# EAGLE design MPHS-RFM69C (EAGLE 7.4.0)
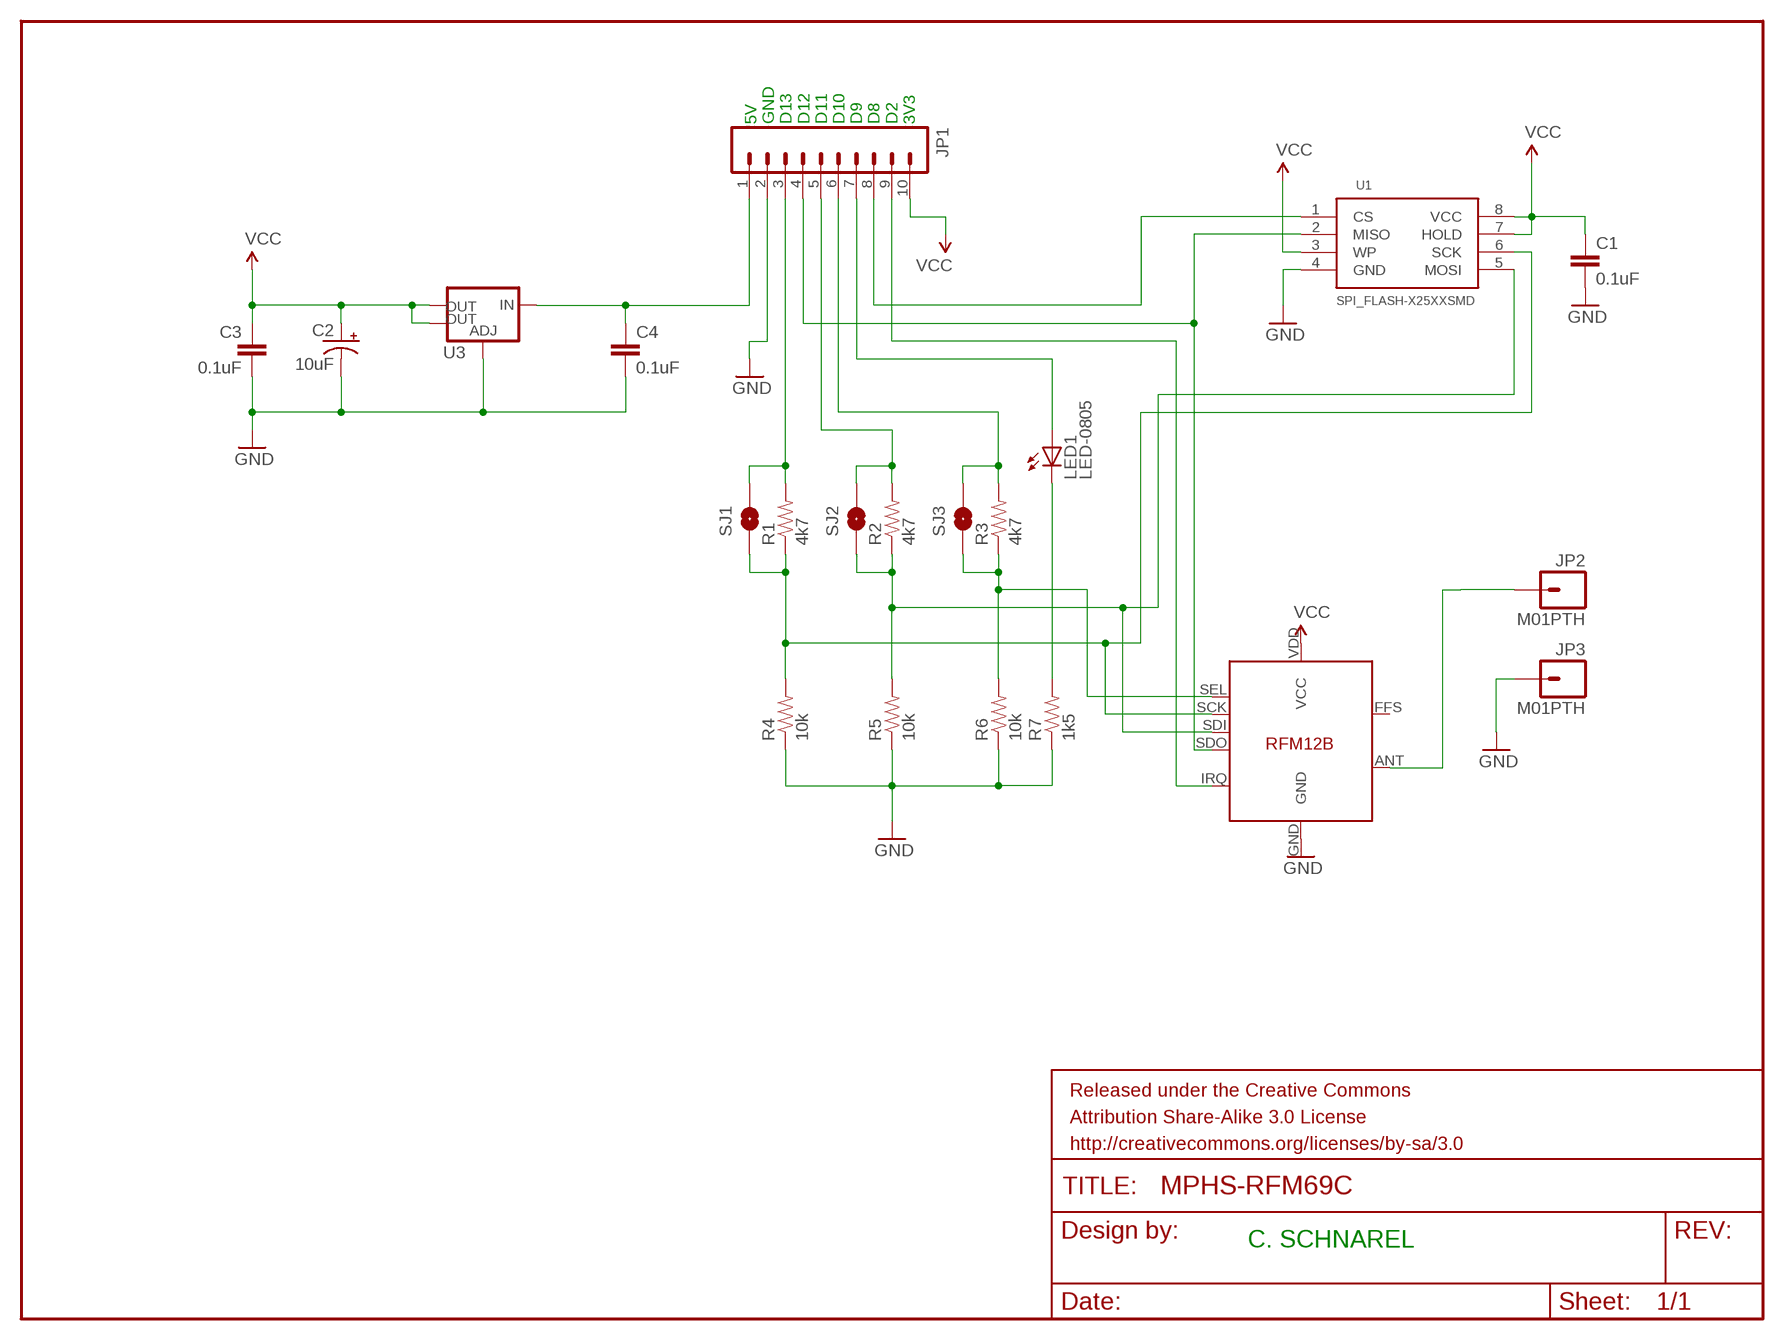
[diagram p0: schematic, sheet 1]

## Parts
C1  0.1uF  CAP0805  [0805]
C2  10uF  CAP_POL0805  [0805-POL]
C3  0.1uF  CAP0805  [0805]
C4  0.1uF  CAP0805  [0805]
FRAME1  FRAME-LETTER  [CREATIVE_COMMONS]
JP1  M10"  [1X10]
JP2  M01PTH  [1X01]
JP3  M01PTH  [1X01]
LED1  LED-0805  [0805-LED]
R1  4k7  RESISTOR0805-RES  [0805]
R2  4k7  RESISTOR0805-RES  [0805]
R3  4k7  RESISTOR0805-RES  [0805]
R4  10k  RESISTOR0805-RES  [0805]
R5  10k  RESISTOR0805-RES  [0805]
R6  10k  RESISTOR0805-RES  [0805]
R7  1k5  RESISTOR0805-RES  [0805]
SJ1  SOLDERJUMPERNO  [SJ_2S-NO]
SJ2  SOLDERJUMPERNO  [SJ_2S-NO]
SJ3  SOLDERJUMPERNO  [SJ_2S-NO]
U1  SPI_FLASH-X25XXSMD  [SO08]
U3  V_REG_LM1117SOT223  [SOT223]
U$1  RFM12B  [RFM12B]

## Nets
GND: C1.2 C2.2(-) C3.2 C4.2 JP1.2 JP3.1 R4.1 R5.1 R6.1 R7.1 U1.4(GND) U3.1(ADJ) U$1.GND
N$1: R3.1 R6.2 SJ3.1 U$1.SEL
N$2: C4.1 JP1.1 U3.3(IN)
N$3: JP1.4 U1.2(MISO) U$1.SDO
N$4: JP1.9 U$1.IRQ
N$5: R2.1 R5.2 SJ2.1 U1.5(MOSI) U$1.SDI
N$6: JP1.3 R1.2 SJ1.2
N$7: JP1.5 R2.2 SJ2.2
N$9: JP1.6 R3.2 SJ3.2
N$10: R1.1 R4.2 SJ1.1 U1.6(SCK) U$1.SCK
N$11: JP2.1 U$1.ANT
N$13: JP1.7 LED1.A
N$14: JP1.8 U1.1(CS)
N$15: LED1.C R7.2
VCC: C1.1 C2.1(+) C3.1 JP1.10 U1.3(WP) U1.7(HOLD) U1.8(VCC) U3.2(OUT) U3.4(OUT) U$1.VDD(VCC)
Unconnected: U$1.FFS

## Notes on the sheet
- 5V
  GND
  D13
  D12
  D11
  D10
  D9
  D8
  D2
  3V3
- C. SCHNAREL

## Library data of the parts
C1 C3 C4 = SparkFun-Capacitors:CAP: Capacitor Standard 0603 ceramic capacitor, and 0.1" leaded capacitor.
C2 = ChipsParts:CAP_POL
FRAME1 = SparkFun-Aesthetics:FRAME-LETTER: Schematic Frame Standard 8.5x11 US Letter frame
JP1 = SparkFun-Connectors:M10: Header 10 Standard 10-pin 0.1" header. Use with straight break away headers (SKU : PRT-00116), right angle break away headers (PRT-00553), swiss pins (PRT-00743), machine pins (PRT-00117), and female headers (PRT-00115).
JP2 JP3 = SparkFun-Connectors:M01: Header 1 Standard 1-pin 0.1" header. Use with straight break away headers (SKU : PRT-00116), right angle break away headers (PRT-00553), swiss pins (PRT-00743), machine pins (PRT-00117), and female headers (PRT-00115).
LED1 = ChipsParts:LED: Generic LED in 0805 package. Both package and symbol copied from SparkFun libraries but they don't have a component LED in 0805.
R1-R7 = SparkFun-Resistors:RESISTOR: Resistor Basic schematic elements and footprints for 0603, 1206, and PTH resistors.
SJ1-SJ3 = SparkFun-Passives:SOLDERJUMPER: Solder Jumper Standard SMD solder jumper. Used to automate production. Two varients : Normally Open and Normally Closed are the same, but have different paste layers. NC will have a large amount of paste and should jumper during reflow.
U1 = SparkFun-DigitalIC:SPI_FLASH-X25XX: 8pin SPI Flash series x25xx. Works with devices like W25X32 and BR25L32
U3 = SparkFun-PowerIC:V_REG_LM1117: Voltage Regulator LM1117 Standard adjustable voltage regulator but in SMD form. Spark Fun Electronics SKU : COM-00595; PROD_ID: VREG-08170
U$1 = ChipsParts:RFM12B

## Board
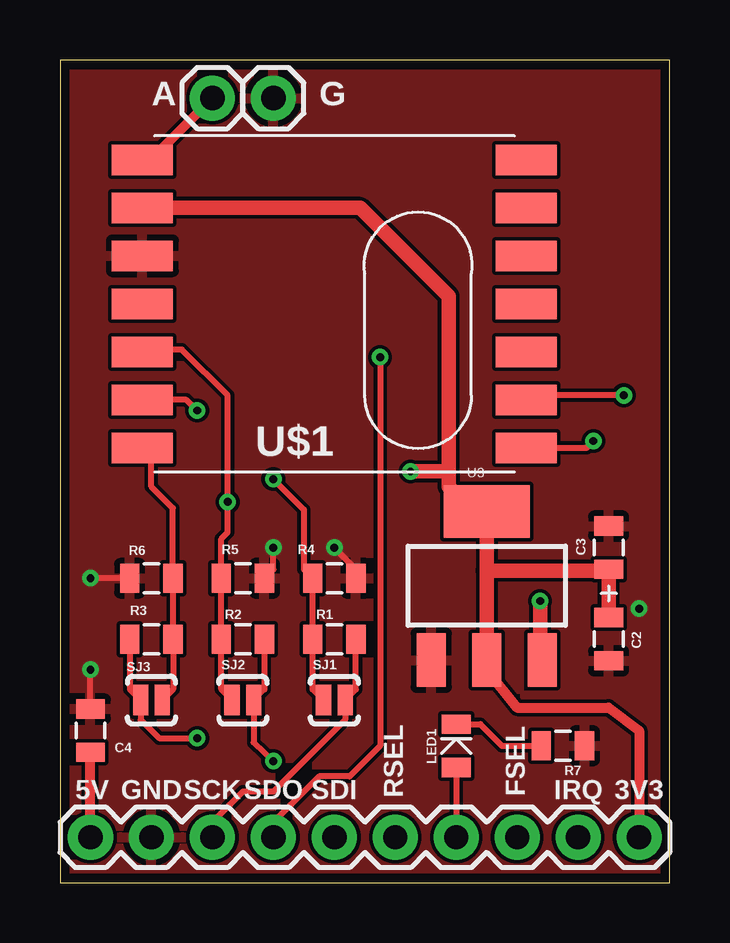
[diagram p1: board, top side]
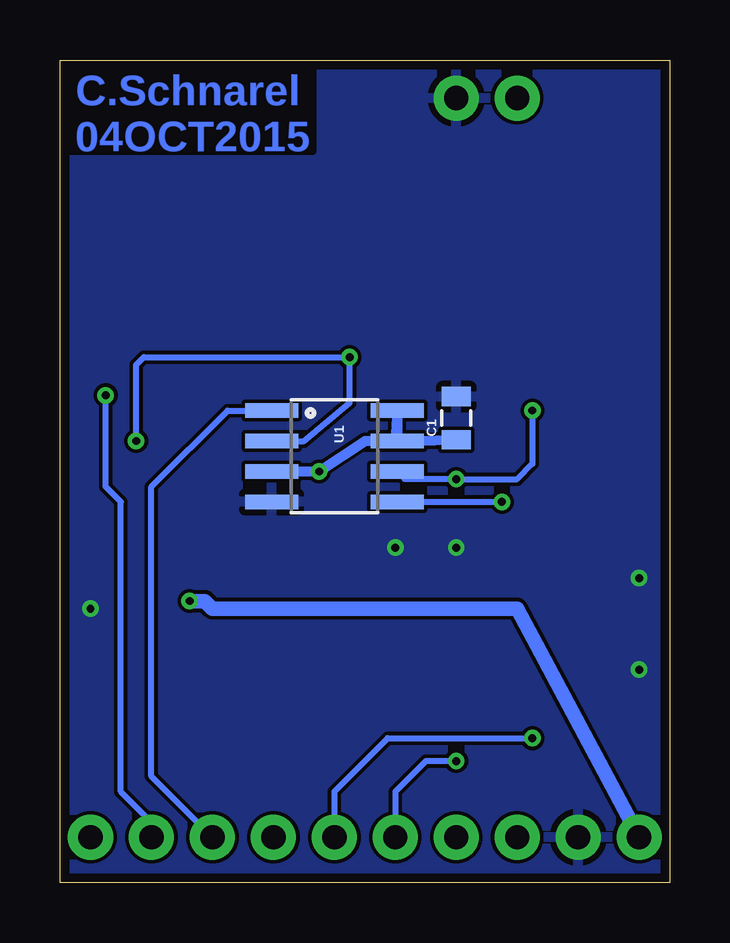
[diagram p2: board, bottom side, seen from below]

Size 25.4 x 34.29 mm. Coordinates in mm from the lower left corner, seen from the top.
Outline: 0,0 25.4,0 25.4,34.29 0,34.29 0,0
Copper layers (1*16): Top 0.0356mm / dielectric 1.5011mm / Bottom 0.0356mm
Design rules "LaenPCBOrder": minimum track width 6mil, minimum drill 13mil, track to track 6mil, track to pad 6mil, pad to pad 6mil, via to via 6mil, smd to smd 6mil, copper to edge 15mil, drill to drill 6mil, minimum pad ring 7mil, minimum via ring 7mil, stop-mask expansion 4mil, vias tented up to drill 0mil, thermal gap 10mil

### Footprints (pad centres in the part's own frame; a part is rotated, then mirrored left to right if it is on the bottom)
0805 = smd 0.8 x 1.2: 1 -0.9,0; 2 0.9,0
0805-POL = smd 0.8 x 1.2: 1 -0.9,0; 2 0.9,0
1X10 = drill 1.016 pad 1.88: 1 0,0; 2 2.54,0; 3 5.08,0; 4 7.62,0; 5 10.16,0; 6 12.7,0; 7 15.24,0; 8 17.78,0; 9 20.32,0; 10 22.86,0
1X01 = drill 1.016 pad 1.88: 1 0,0
0805-LED = smd 0.8 x 1.2: A -0.9,0; C 0.9,0
SJ_2S-NO = smd 0.635 x 1.27: 1 -0.45,0; 2 0.45,0
SO08 = smd 0.61 x 2.21: 1 -1.905,-2.616; 2 -0.635,-2.616; 3 0.635,-2.616; 4 1.905,-2.616; 5 1.905,2.616; 6 0.635,2.616; 7 -0.635,2.616; 8 -1.905,2.616
SOT223 = smd 1.219 x 2.235: 1 -2.311,-3.099; 2 0,-3.099; 3 2.311,-3.099 | smd 3.6 x 2.2: 4 0,3.099
RFM12B = smd 2.54 x 1.27: ANT 8,-6; FFS -8,2; GND 8,-2; IRQ -8,4; P$8 -8,0; P$9 -8,-2; P$10 -8,-4; P$12 -8,-6; P$16 8,0; SCK 8,4; SDI 8,2; SDO -8,6; SEL 8,6; VDD 8,-4

### Placement (x,y rotation side)
C1  8.89,19.37 90 bottom
C2  22.86,10.16 270 top
C3  22.86,13.97 90 top
C4  1.27,6.35 90 top
FRAME1  17.78,-8.89 0 top  (outside the outline)
JP1  1.27,1.91 0 top
JP2  6.35,32.7 0 top
JP3  8.89,32.7 0 top
LED1  16.51,5.71 90 top
R1  11.43,10.16 0 top
R2  7.62,10.16 0 top
R3  3.81,10.16 180 top
R4  11.43,12.7 180 top
R5  7.62,12.7 180 top
R6  3.81,12.7 0 top
R7  20.95,5.71 180 top
SJ1  11.43,7.62 0 top
SJ2  7.62,7.62 0 top
SJ3  3.81,7.62 180 top
U1  13.97,17.78 270 bottom
U3  17.78,12.38 0 top
U$1  11.43,24.13 180 top

### Tracks (layer width: path | path; a pad name or v marks a point on that pad's centre or on a via)
GND  (via drill 0.33)
  Top 0.254: R5.1 8.89,13.07 v8.89,13.97 | C4.2 v1.27,8.89 | R6.1 v1.27,12.7 | R4.1 12.33,13.07 v11.43,13.97
  other vias: 24.13,11.43
  pour Bottom: 0,0 0,34.29 25.4,34.29 25.4,0
  pour Top: 0,0 0,34.29 25.4,34.29 25.4,0
N$1
  Top 0.254: SJ3.1 4.71,8.07 R3.1 R6.2 4.7,15.62 3.81,16.51 3.81,17.75 U$1.SEL
N$2  (via drill 0.33)
  Top 0.406: JP1.1 C4.1
  Top 0.61: U3.3 20,9.69 v20,11.75
  Bottom 0.61: JP1.1 6.35,11.43 19.05,11.43 19.37,11.75 v20,11.75
N$3  (via drill 0.33, 0.33 pad 0.33)
  Top 0.254: v13.34,21.91 13.34,5.71 12.06,4.45 10.79,4.45 8.89,2.54 JP1.4 | U$1.SDO 21.94,18.13 v22.23,18.41
  Bottom 0.254: U1.2 15.24,18.41 13.34,20 v13.34,21.91 21.91,21.91 22.23,21.59 v22.23,18.41
N$4  (via drill 0.33)
  Top 0.254: v23.5,20.32 19.62,20.32 U$1.IRQ
  Bottom 0.254: v23.5,20.32 23.5,16.51 22.86,15.88 22.86,3.81 21.59,2.54 JP1.9
N$5  (via drill 0.33)
  Top 0.254: SJ2.1 6.72,8.07 R2.1 R5.2 6.72,14.34 6.99,14.61 v6.99,15.88 6.99,20.32 5.08,22.23 3.52,22.23 U$1.SDI
  Bottom 0.254: U1.5 v6.99,15.88
N$6
  Top 0.254: R1.2 12.33,8.07 SJ1.2 11.88,6.8 8.89,3.81 7.62,3.81 6.35,2.54 JP1.3
N$7  (via drill 0.33)
  Top 0.254: R2.2 8.52,8.07 SJ2.2 8.07,5.85 v8.89,5.08
  Bottom 0.254: v8.89,5.08 10.16,5.08 11.43,3.81 JP1.5
N$9  (via drill 0.33)
  Top 0.254: R3.2 2.91,8.07 SJ3.2 3.36,6.8 4.13,6.03 v5.71,6.03
  Bottom 0.254: v5.71,6.03 11.75,6.03 13.97,3.81 JP1.6
N$10  (via drill 0.33)
  Top 0.254: SJ1.1 10.53,8.07 R1.1 R4.2 10.16,13.07 10.16,15.56 v8.89,16.83 | v5.71,19.68 5.27,20.13 U$1.SCK
  Bottom 0.254: U1.6 11.04,16.83 v8.89,16.83 6.35,16.83 5.71,17.46 v5.71,19.68
N$11
  Top 0.406: U$1.ANT 3.78,30.13 JP2.1
N$13
  Top 0.254: LED1.A JP1.7
N$14
  Bottom 0.254: JP1.8 21.59,4.45 21.59,16.51 18.41,19.68 U1.1
N$15
  Top 0.254: R7.2 18.41,5.71 17.52,6.62 LED1.C
VCC  (via drill 0.33)
  Top 0.406: JP1.10 24.13,6.35 22.86,7.3 19.05,7.3 17.78,8.89 U3.2
  Top 0.61: v14.61,17.14 16.19,17.14 | 16.19,17.14 16.19,24.45 12.51,28.13 U$1.VDD | 16.19,17.14 16.19,16.51 16.83,15.88 17.14,15.88 U3.4 17.78,13.02 | 17.78,13.02 U3.2 | 17.78,13.02 22.59,13.02 C3.1 C2.1
  Bottom 0.406: U1.3 v14.61,17.14 12.7,18.41 U1.7 U1.8 11.43,18.41 C1.1

### Text on the board
Bottom: C.Schnarel / 04OCT2015
tPlace: A | G | RSEL | FSEL | 5V | GND | SCK | SDO | SDI | IRQ | 3V3